# EAGLE design D1ZIG (EAGLE 9.6.2)
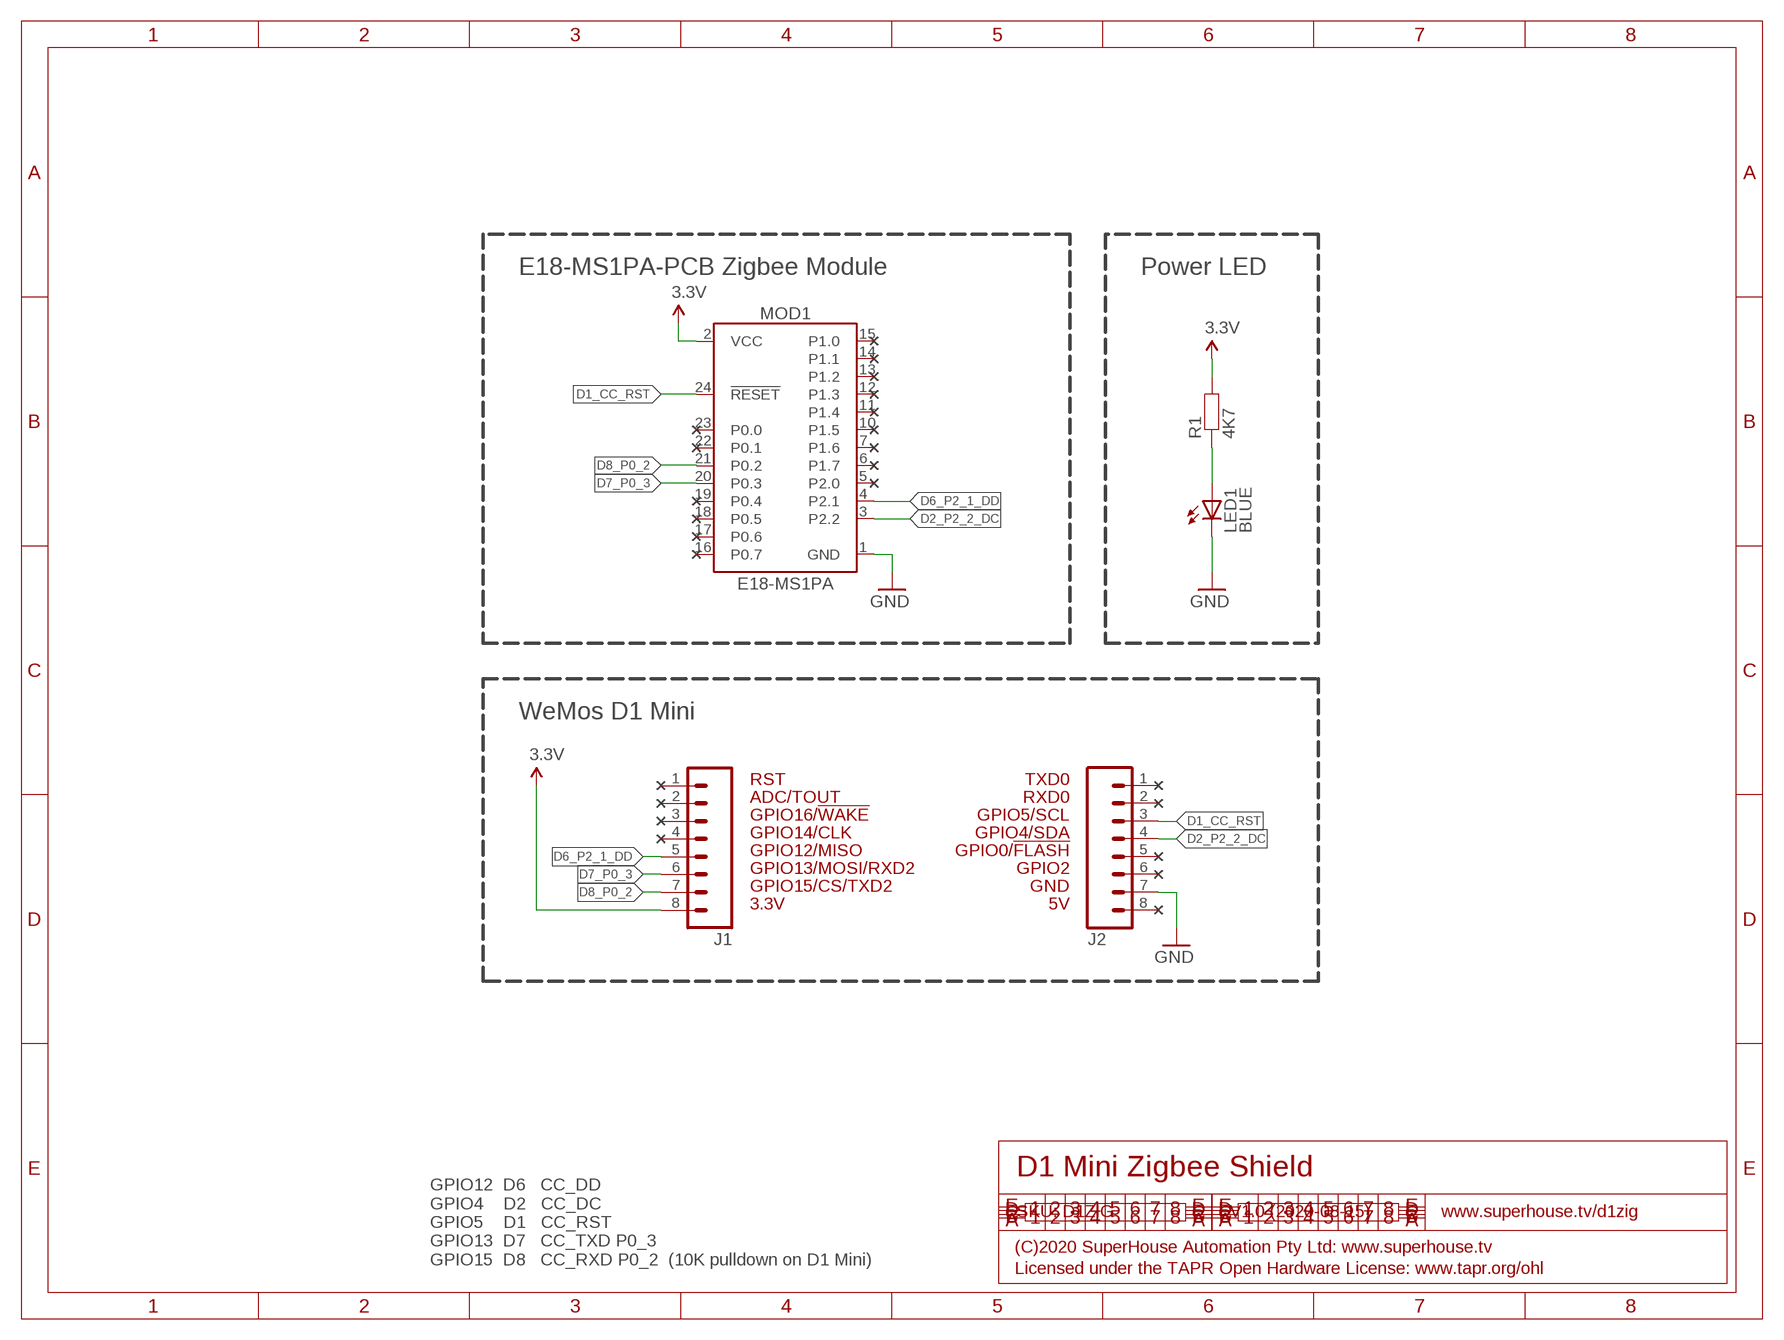
[diagram p0: schematic, sheet 1]

## Parts
J1  M08  [1X08]
J2  M08  [1X08]
LED1  BLUE  LED0603  [LED-0603]
MOD1  E18-MS1PA  [E18-MS1PA-PCB]
R1  4K7  RESISTOR0603  [R0603]

## Nets
3.3V: J1.8 MOD1.2(VCC) R1.2
D1_CC_RST: J2.3 MOD1.24(!RESET)
D2_P2_2_DC: J2.4 MOD1.3(P2.2)
D6_P2_1_DD: J1.5 MOD1.4(P2.1)
D7_P0_3: J1.6 MOD1.20(P0.3)
D8_P0_2: J1.7 MOD1.21(P0.2)
GND: J2.7 LED1.C MOD1.1(GND)
N$1: LED1.A R1.1
Unconnected: J1.1 J1.2 J1.3 J1.4 J2.1 J2.2 J2.5 J2.6 J2.8 MOD1.5(P2.0) MOD1.6(P1.7) MOD1.7(P1.6) MOD1.10(P1.5) MOD1.11(P1.4) MOD1.12(P1.3) MOD1.13(P1.2) MOD1.14(P1.1) MOD1.15(P1.0) MOD1.16(P0.7) MOD1.17(P0.6) MOD1.18(P0.5) MOD1.19(P0.4) MOD1.22(P0.1) MOD1.23(P0.0)

## Notes on the sheet
- E18-MS1PA-PCB Zigbee Module | Power LED
- WeMos D1 Mini
- RST | TXD0
- ADC/TOUT | RXD0
- GPIO16/!WAKE | GPIO5/SCL
- GPIO14/CLK | GPIO4/SDA
- GPIO12/MISO | GPIO0/!FLASH
- GPIO13/MOSI/RXD2 | GPIO2
- GPIO15/CS/TXD2 | GND
- 3.3V | 5V
- D1 Mini Zigbee Shield
- SKU: D1ZIG | V1.0 (2020-08-15) | www.superhouse.tv/d1zig
- (C)2020 SuperHouse Automation Pty Ltd: www.superhouse.tv
- GPIO12  D6   CC_DD
  GPIO4    D2   CC_DC
  GPIO5    D1   CC_RST
  GPIO13  D7   CC_TXD P0_3
  GPIO15  D8   CC_RXD P0_2  (10K pulldown on D1 Mini)
- Licensed under the TAPR Open Hardware License: www.tapr.org/ohl

## Library data of the parts
J1 J2 = freetronics-original:M08: Header 8 Standard 8-pin 0.1" header. Use with straight break away headers (SKU : PRT-00116), right angle break away headers (PRT-00553), swiss pins (PRT-00743), machine pins (PRT-00117), and female headers (PRT-00115).
LED1 = SuperHouse-LEDs:LED: LEDs Standard schematic elements and footprints for 5mm, 3mm, 1206, and 0603 sized LEDs. 5mm - Spark Fun Electronics SKU : COM-00529 (and others)
MOD1 = SuperHouse-Modules:E18-MS1PA
R1 = SuperHouse-DiscreteSemi:RESISTOR: Resistor Standard resistors.

## Net classes
0 default: width 0.203 mm, drill 0.356 mm, clearance 0.152 mm
1 power: width 0.203 mm, clearance 0.152 mm

## Board
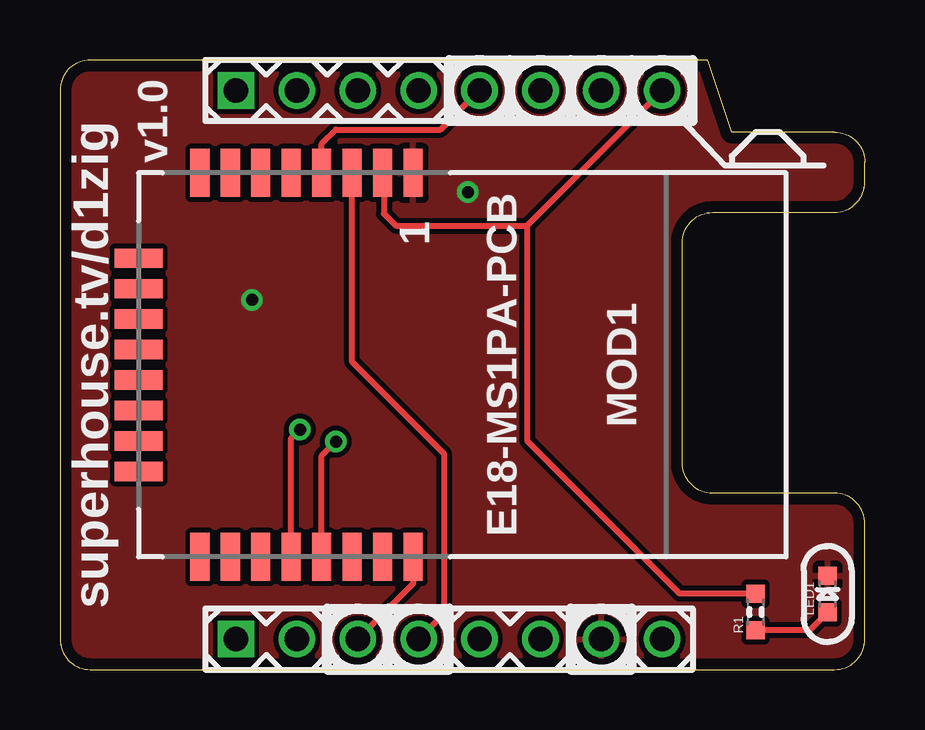
[diagram p1: board, top side]
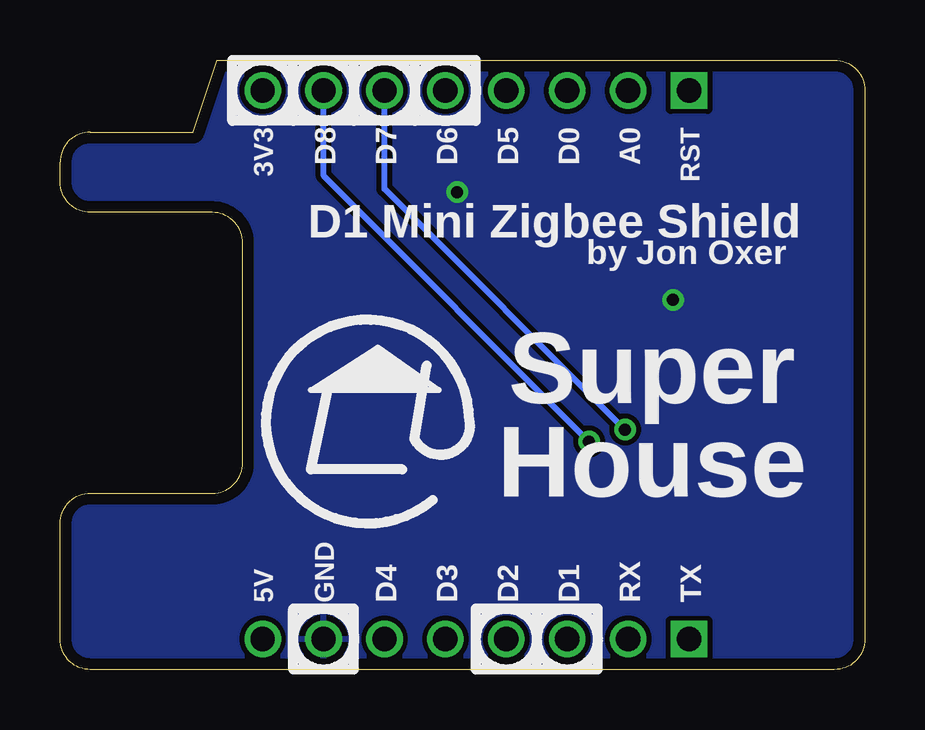
[diagram p2: board, bottom side, seen from below]

Size 33.56 x 25.4 mm. Coordinates in mm from the lower left corner, seen from the top.
Outline: 1.27,0 32.29,0 arc90 33.56,1.27 33.56,6.08 arc90 32.29,7.35 27.21,7.35 arc-90 25.94,8.62 25.94,17.78 arc-90 27.21,19.05 32.29,19.05 arc90 33.56,20.32 33.56,21.13 arc90 32.29,22.4 28,22.4 27,25.4 1.27,25.4 arc90 0,24.13 0,1.27 arc90 1.27,0
Copper layers (1*16): Top 0.035mm / dielectric 1.5mm / Bottom 0.035mm
Design rules "SuperHouse-Design-Rules": minimum track width 10mil, minimum drill 24mil, track to track 8mil, track to pad 8mil, pad to pad 8mil, via to via 8mil, smd to smd 6mil, copper to edge 18mil, drill to drill 8mil, minimum pad ring 7mil, minimum via ring 8mil, stop-mask expansion 4mil, vias tented up to drill 0.5mm, thermal gap 10mil

### Footprints (pad centres in the part's own frame; a part is rotated, then mirrored left to right if it is on the bottom)
1X08 = drill 1.016 square: 1 0,0 | drill 1.016: 2 2.54,0; 3 5.08,0; 4 7.62,0; 5 10.16,0; 6 12.7,0; 7 15.24,0; 8 17.78,0
LED-0603 = smd 0.762 x 0.762: A -0.762,0; C 0.762,0
E18-MS1PA-PCB = smd 2 x 0.8: 1 -8,-2.06; 2 -8,-3.33; 3 -8,-4.6; 4 -8,-5.87; 5 -8,-7.14; 6 -8,-8.41; 7 -8,-9.68; 8 -8,-10.95; 17 8,-10.95; 18 8,-9.68; 19 8,-8.41; 20 8,-7.14; 21 8,-5.87; 22 8,-4.6; 23 8,-3.33; 24 8,-2.06 | smd 0.8 x 2: 9 -4.445,-13.5; 10 -3.175,-13.5; 11 -1.905,-13.5; 12 -0.635,-13.5; 13 0.635,-13.5; 14 1.905,-13.5; 15 3.175,-13.5; 16 4.445,-13.5
R0603 = smd 0.762 x 0.762: 1 -0.762,0; 2 0.762,0

### Placement (x,y rotation side)
J1  7.33,24.13 0 top
J2  7.33,1.27 0 top
LED1  32,3.15 90 top
MOD1  16.78,12.7 270 top
R1  29,2.4 90 top

### Tracks (layer width: path | path; a pad name or v marks a point on that pad's centre or on a via)
3.3V
  Top 0.254: MOD1.2 13.5,20.65 13.5,19 14,18.5 19.48,18.5 19.49,18.51 | 19.49,18.51 J1.8 | R1.2 25.84,3.16 19.49,9.51 19.49,18.51
D1_CC_RST
  Top 0.254: MOD1.24 14.72,3.58 J2.3
D2_P2_2_DC
  Top 0.254: MOD1.3 12.18,12.82 16,9 16,2.32 J2.4
D6_P2_1_DD
  Top 0.254: MOD1.4 10.91,21.91 11.5,22.5 15.86,22.5 J1.5
D7_P0_3  (via drill 0.5)
  Top 0.254: MOD1.20 9.64,9.64 v10,10
  Bottom 0.254: v10,10 20.03,20.03 J1.6
D8_P0_2  (via drill 0.5)
  Top 0.254: MOD1.21 10.91,8.91 v11.5,9.5
  Bottom 0.254: v11.5,9.5 22.57,20.57 J1.7
GND  (via drill 0.5)
  other vias: 17,19.9 8,15.4
  pour Bottom: 1.27,0 arc-90 0,1.27 0,24.13 arc-90 1.27,25.4 27,25.4 28,22.4 32.29,22.4 arc-90 33.56,21.13 33.56,20.32 arc-90 32.29,19.05 27.21,19.05 arc90 25.94,17.78 25.94,8.62 arc90 27.21,7.35 32.29,7.35 arc-90 33.56,6.08 33.56,1.27 arc-90 32.29,0
  pour Top: 32.29,0 1.27,0 arc-90 0,1.27 0,24.13 arc-90 1.27,25.4 27,25.4 28,22.4 32.29,22.4 arc-90 33.56,21.13 33.56,20.32 arc-90 32.29,19.05 27.21,19.05 arc90 25.94,17.78 25.94,8.62 arc90 27.21,7.35 32.29,7.35 arc-90 33.56,6.08 33.56,1.27 arc-90
N$1
  Top 0.254: R1.1 31.25,1.64 LED1.A

### Text on the board
tPlace: v1.0 | superhouse.tv/d1zig
bPlace: RST | A0 | D0 | D5 | D6 | D7 | D8 | 3V3 | D1 Mini Zigbee Shield | by Jon Oxer | Super / House | TX | RX | D1 | D2 | D3 | D4 | GND | 5V